# EAGLE design RotaryEncoder_8Ch_Selectable (EAGLE 6.5.0)
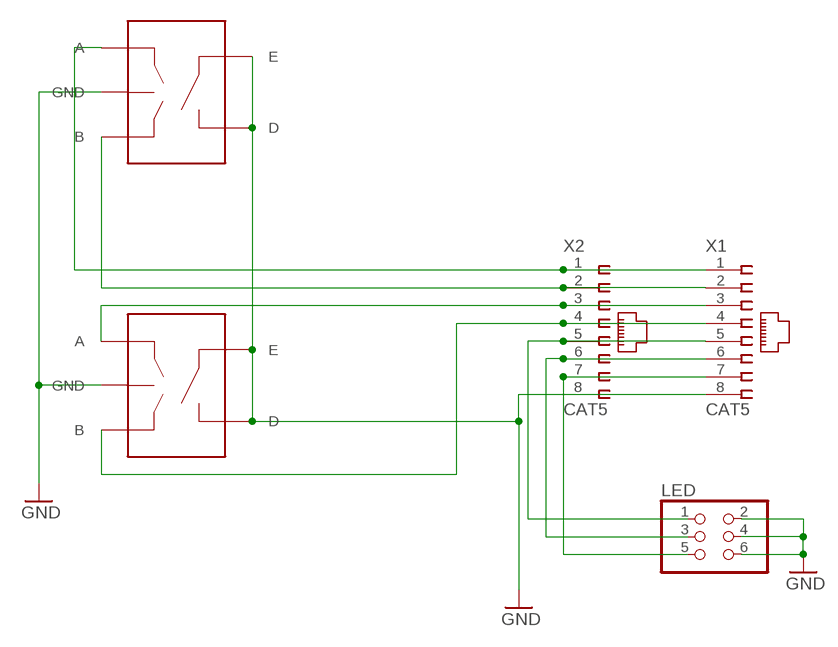
[diagram p0: schematic, sheet 1]

## Parts
ENC1  PEC09  [PEC092320FS]
ENC2  PEC09  [PEC092320FS]
LED  PINHD-2X3  [2X03]
X1  CAT5  [555164-1]
X2  CAT5  [555164-1]

## Nets
GND: ENC1.C(GND) ENC1.D ENC1.E ENC2.C(GND) ENC2.D ENC2.E LED.2 LED.4 LED.6 X1.8 X2.8
N$1: LED.3 X1.6 X2.6
N$3: LED.5 X1.7 X2.7
N$4: LED.1 X1.5 X2.5
N$5: ENC2.B X1.4 X2.4
N$6: ENC2.A X1.3 X2.3
N$7: ENC1.B X1.2 X2.2
N$8: ENC1.A X1.1 X2.1

## Library data of the parts
ENC1 ENC2 = connector-jqi:PEC09: PEC09-2320F-S0015 Rotary Encoder (Bourns).
LED = pinhead:PINHD-2X3: PIN HEADER
X1 X2 = connector-jqi:CAT5: Standard CAT-5 Ethernet jack.; DIGIKEY: A31442-ND

## Board
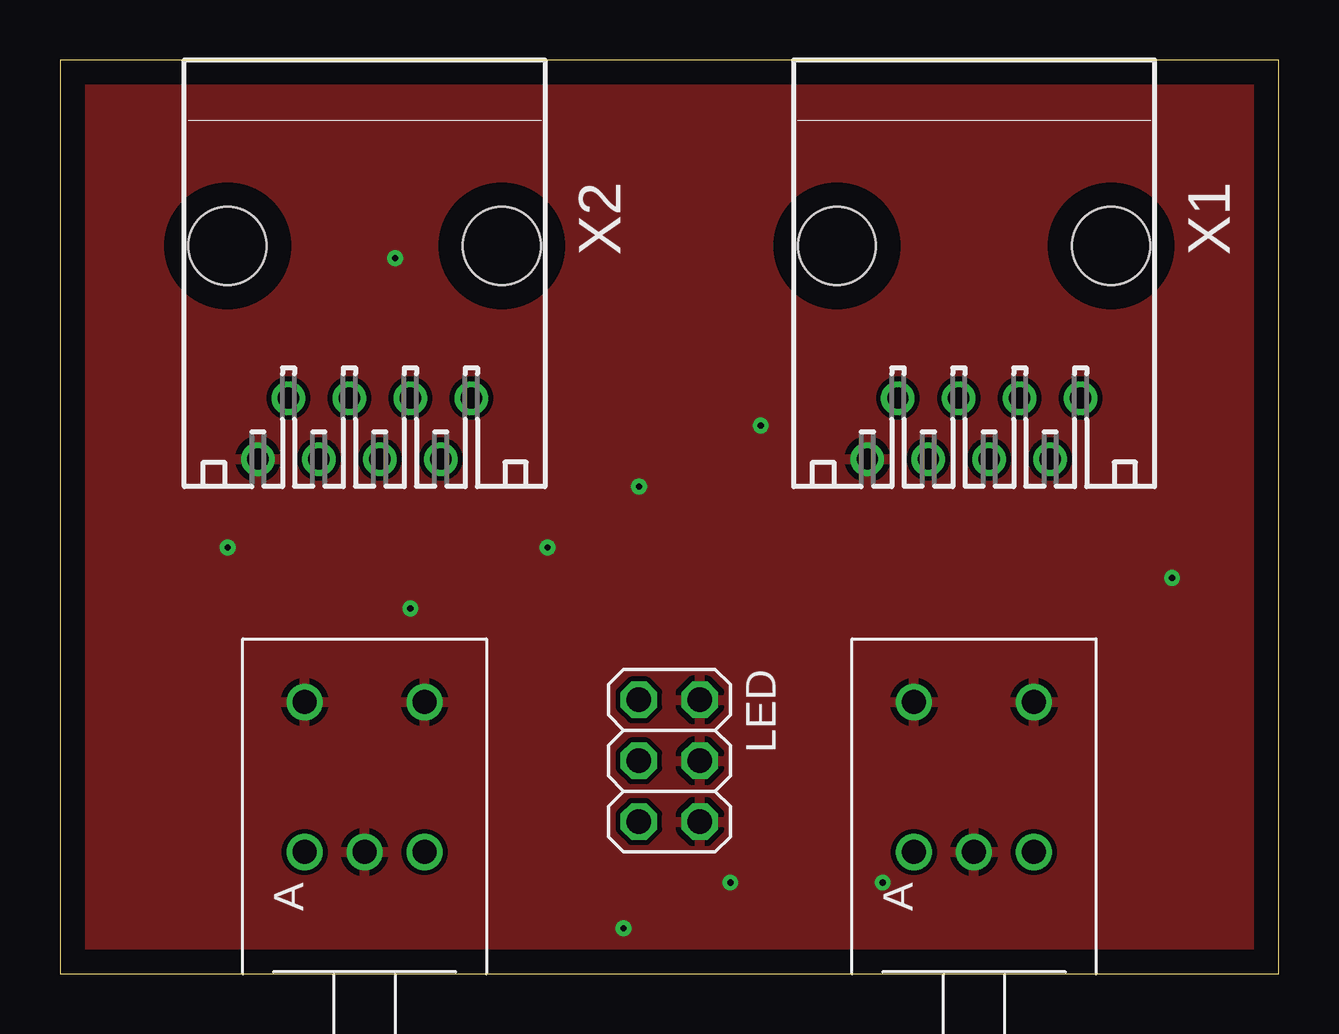
[diagram p1: board, top side]
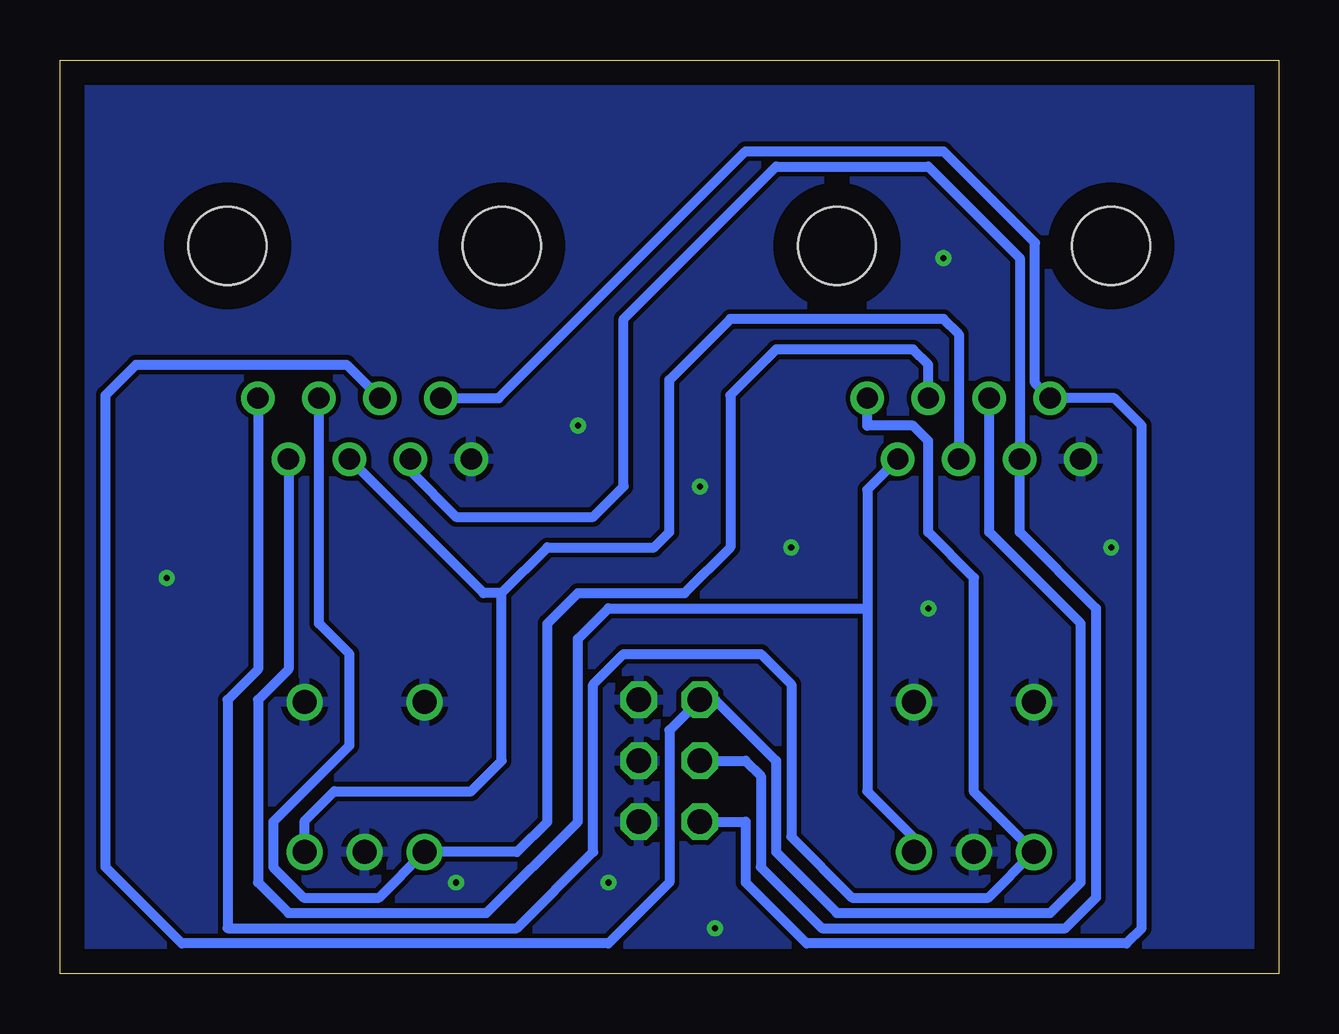
[diagram p2: board, bottom side, seen from below]

Size 50.8 x 38.1 mm. Coordinates in mm from the lower left corner, seen from the top.
Outline: 0,0 50.8,0 50.8,38.1 0,38.1 0,0
Copper layers (1*16): Top 0.035mm / dielectric 1.5mm / Bottom 0.035mm
Design rules "default": minimum track width 10mil, minimum drill 24mil, track to track 8mil, track to pad 8mil, pad to pad 8mil, via to via 8mil, smd to smd 8mil, copper to edge 40mil, drill to drill 8mil, minimum pad ring 10mil, minimum via ring 8mil, stop-mask expansion 4mil, vias tented up to drill 0mil, thermal gap 10mil

### Footprints (pad centres in the part's own frame; a part is rotated, then mirrored left to right if it is on the bottom)
PEC092320FS = drill 1: A 0,-2.5; B 0,2.5; C 0,0; D -6.25,-2.5; E -6.25,2.5
2X03 = drill 1.016 octagon: 1 -2.54,-1.27; 2 -2.54,1.27; 3 0,-1.27; 4 0,1.27; 5 2.54,-1.27; 6 2.54,1.27
555164-1 = drill 0.889: 1 -4.445,6.477; 2 -3.175,9.017; 3 -1.905,6.477; 4 -0.635,9.017; 5 0.635,6.477; 6 1.905,9.017; 7 3.175,6.477; 8 4.445,9.017 | hole 3.251: -5.715,0.127; 5.715,0.127

### Placement (x,y rotation side)
ENC1  12.7,5.08 270 top
ENC2  38.1,5.08 270 top
LED  25.4,8.89 270 top
X1  38.1,30.48 180 top
X2  12.7,30.48 180 top

### Tracks (layer width: path | path; a pad name or v marks a point on that pad's centre or on a via)
GND  (via drill 0.25)
  other vias: 24.13,20.32 29.21,22.86 14.61,15.24 6.99,17.78 27.94,3.81 23.5,1.91 46.35,16.51 20.32,17.78 13.97,29.84 34.29,3.81
  pour Bottom: 0,38.73 0,0 50.8,0 50.8,38.73
  pour Top: 0,38.73 0,0 50.8,0 50.8,38.73
N$1
  Bottom 0.406: X1.6 36.2,20.95 34.29,19.05 28.57,19.05 27.3,20.32 27.3,27.3 20.95,33.66 14.61,33.66 10.79,29.84 X2.6 10.79,18.41 7.62,15.24 7.62,3.17 8.89,1.91 19.05,1.91 21.59,4.45 21.59,8.26 22.23,8.89 LED.3
N$3
  Bottom 0.406: X1.7 32.51,24 22.23,34.29 13.97,34.29 10.16,30.48 10.16,24.64 X2.7 6.86,24 5.71,22.86 5.71,1.91 6.35,1.27 19.68,1.27 22.23,3.81 22.23,6.35 LED.5
N$4
  Bottom 0.406: X2.5 12.06,18.41 8.26,14.61 8.26,3.81 9.53,2.54 18.41,2.54 20.95,5.08 20.95,8.89 23.5,11.43 LED.1 25.4,10.16 25.4,3.81 27.94,1.27 45.72,1.27 48.9,4.45 48.9,24.13 47.62,25.4 38.86,25.4 X1.5
N$5
  Bottom 0.406: ENC2.B 40.6,6.39 39.37,7.62 33.66,7.62 32.38,8.89 32.38,15.88 | 32.38,15.88 30.48,17.78 26.04,17.78 25.4,18.41 25.4,24.77 22.86,27.3 13.97,27.3 13.34,26.67 X2.4 | 32.38,15.88 33.15,15.88 X1.4
N$6
  Bottom 0.406: X2.3 14.61,25.4 15.24,26.04 20.95,26.04 22.86,24.13 22.86,17.78 24.77,15.88 29.21,15.88 30.48,14.61 30.48,6.35 31.75,5.08 ENC2.A 37.51,3.17 40.64,3.17 41.91,4.45 41.91,6.35 38.73,9.53 38.73,13.34 40.01,14.61 X1.3
N$7
  Bottom 0.406: X2.2 17.14,20.19 17.14,15.24 | ENC1.B 15.2,5.67 17.14,7.62 17.14,15.24 | X1.2 41.27,12.7 42.55,11.43 42.55,3.81 41.27,2.54 33.02,2.54 29.21,6.35 29.21,13.97 27.94,15.24 17.14,15.24
N$8
  Bottom 0.406: X2.1 17.14,22.86 15.24,22.86 14.61,22.23 14.61,18.41 12.7,16.51 12.7,7.58 ENC1.A 12.11,3.17 17.78,3.17 20.32,5.71 20.32,12.06 21.59,13.34 27.3,13.34 28.57,12.06 28.57,5.08 31.75,1.91 43.81,1.91 43.81,11.43 42.55,12.7 X1.1